# EAGLE schematic schematic (EAGLE 7.2.0)
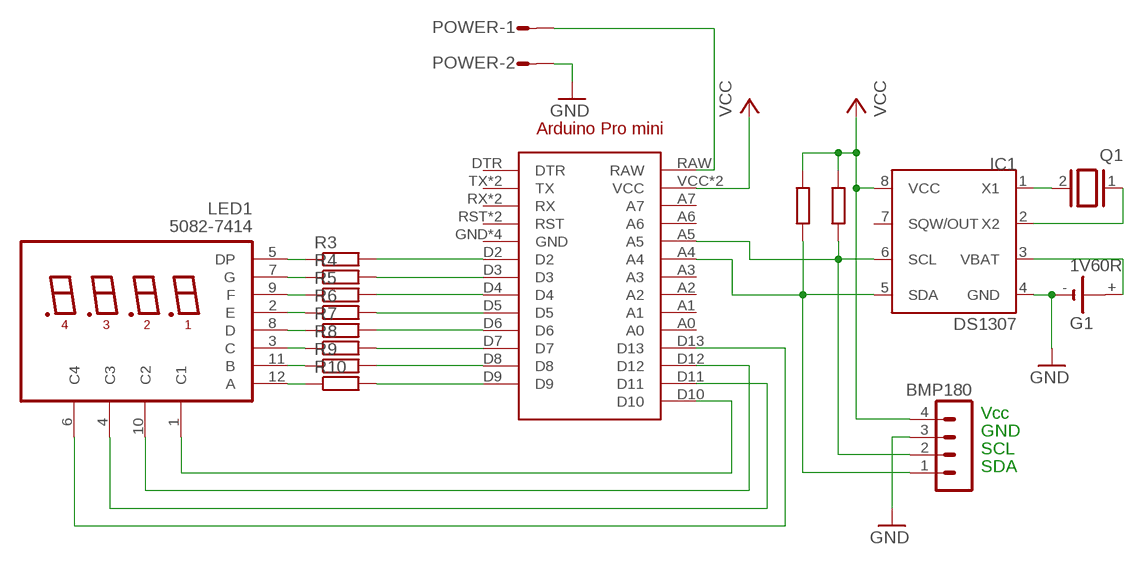
[diagram p0: schematic, sheet 1]

## Parts
ARDUINO1  ARDUINO_PRO_MINI  [ARDUINO_PRO_MINI]
BMP180  MA04-1  [MA04-1]
G1  1V60R  [1V60R]
IC1  DS1307  [SOIC-8]
LED1  5082-7414  [5082-7414]
POWER  L02P  [L02P]
Q1  XTAL  [Q]
R3  R-EU_0204/2V  [0204V]
R4  R-EU_0204/2V  [0204V]
R5  R-EU_0204/2V  [0204V]
R6  R-EU_0204/2V  [0204V]
R7  R-EU_0204/2V  [0204V]
R8  R-EU_0204/2V  [0204V]
R9  R-EU_0204/2V  [0204V]
R10  R-EU_0204/2V  [0204V]

## Nets
GND: BMP180.3 G1.- IC1.4(GND) POWER.2
N$1: IC1.1(X1) Q1.2
N$2: IC1.2(X2) Q1.1
N$3: G1.+ IC1.3(VBAT)
N$4: LED1.11(B) R9.1
N$5: LED1.12(A) R10.1
N$6: LED1.3(C) R8.1
N$7: LED1.8(D) R7.1
N$8: LED1.2(E) R6.1
N$9: LED1.9(F) R5.1
N$10: LED1.5(DP) R3.1
N$11: LED1.7(G) R4.1
N$12: ARDUINO1.D10 LED1.1(C1)
N$13: ARDUINO1.D12 LED1.10(C2)
N$14: ARDUINO1.D11 LED1.4(C3)
N$15: ARDUINO1.D13 LED1.6(C4)
N$16: ARDUINO1.D9 R10.2
N$17: ARDUINO1.RAW POWER.1
N$18: ARDUINO1.D8 R9.2
N$19: ARDUINO1.D7 R8.2
N$20: ARDUINO1.D6 R7.2
N$21: ARDUINO1.D5 R6.2
N$22: ARDUINO1.D4 R5.2
N$23: ARDUINO1.D3 R4.2
N$24: ARDUINO1.D2 R3.2
SCL: ARDUINO1.A5 BMP180.2 IC1.6(SCL)
SDA: ARDUINO1.A4 BMP180.1 IC1.5(SDA)
VCC: ARDUINO1.VCC ARDUINO1.VCC@1(VCC) BMP180.4 IC1.8(VCC)
Unconnected: ARDUINO1.A0 ARDUINO1.A1 ARDUINO1.A2 ARDUINO1.A3 ARDUINO1.A6 ARDUINO1.A7 ARDUINO1.DTR ARDUINO1.RST ARDUINO1.RST@1(RST) ARDUINO1.RX ARDUINO1.RX@1(RX) ARDUINO1.TX ARDUINO1.TX@1(TX) G1.+@1(+) IC1.7(SQW/OUT)

## Notes on the sheet
- Vcc
- GND
- SCL
- SDA

## Power pins joined to a net without a drawn wire
GND: ARDUINO1.GND ARDUINO1.GND@1(GND) ARDUINO1.GND@2(GND) ARDUINO1.GND@3(GND)

## Library data of the parts
ARDUINO1 = arduinopromini:ARDUINO_PRO_MINI: For creating Arduino Pro Mini shields
BMP180 = con-lstb:MA04-1: PIN HEADER; OC_FARNELL: unknown; OC_NEWARK: unknown
G1 = battery:1V60R: NC ACCU Varta
IC1 = dallas-1:DS1307: I2C Serial RTC w/56 bytes battery backed RAM
LED1 = hp-displays:5082-7414: 4 digits X 7-segment + DP LED display
POWER = con-amp-mt:L02P: AMP MT CONNECTOR; OC_FARNELL: unknown; OC_NEWARK: unknown
Q1 = special:XTAL: CRYSTAL
R3-R10 = rcl:R-EU_: RESISTOR, European symbol